# EAGLE schematic test (EAGLE 9.6.2)

## Sheet 1 of 3: Connectors
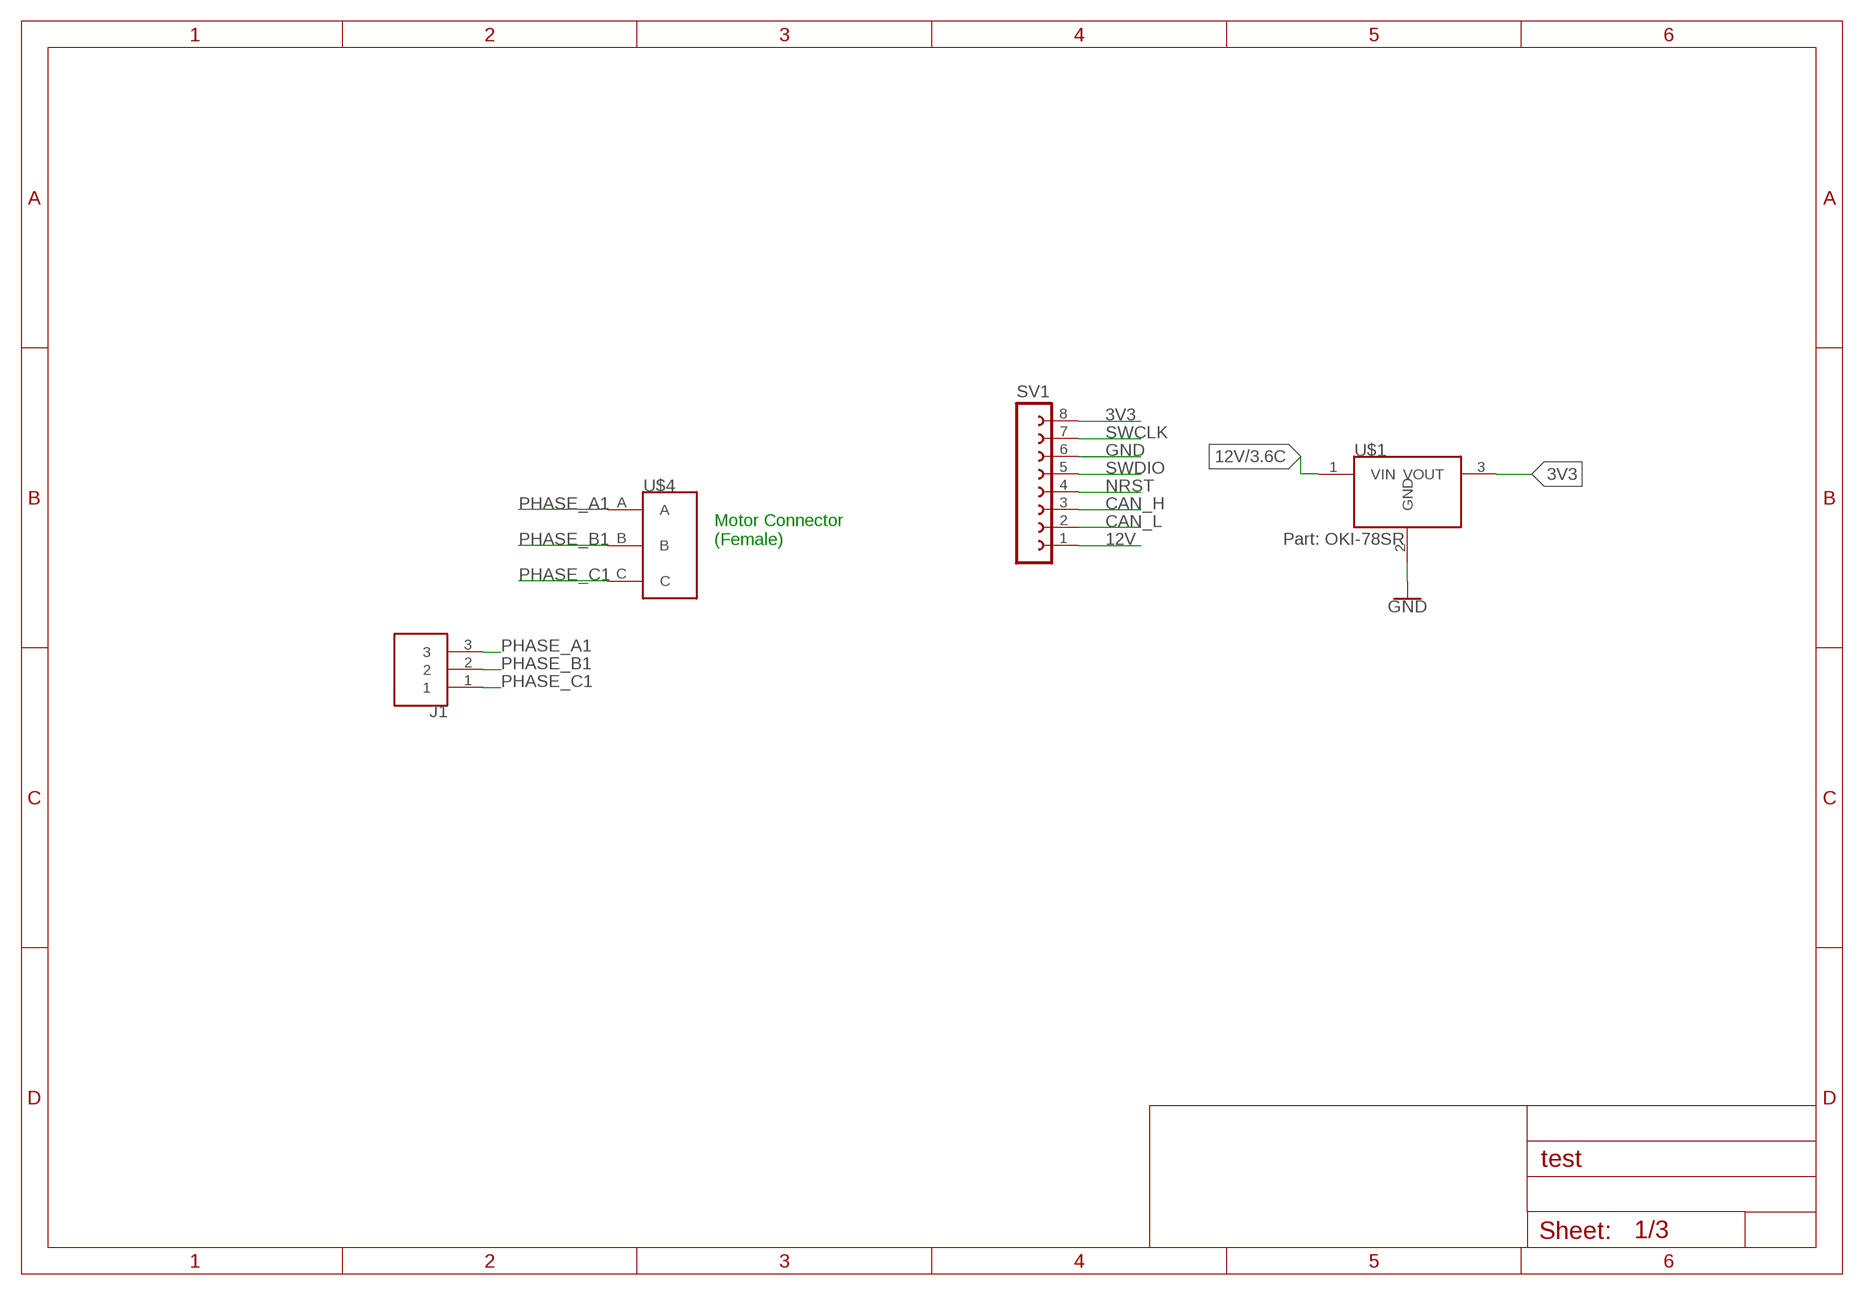
[diagram p0: schematic, sheet 1]

### Parts
J1  284512-3  [284512-3]
SV1  FE08-1  [FE08]
U$1  MURATA-DC-DC  [MURATA-DC-DC]
U$4  3PINCONNECTOR  [3PINCONNECTOR]

### Nets
3V3: SV1.8 U$1.3(VOUT) ; also sheet 2
12V: SV1.1 U$1.1(VIN) ; also sheet 3
CAN_H [diff_pair]: SV1.3 ; also sheet 2
CAN_L [diff_pair]: SV1.2 ; also sheet 2
GND: SV1.6 U$1.2(GND) ; also sheet 2,3
NRST: SV1.4 ; also sheet 2
PHASE_A1: J1.3 U$4.A ; also sheet 3
PHASE_B1: J1.2 U$4.B ; also sheet 3
PHASE_C1: J1.1 U$4.C ; also sheet 3
SWCLK: SV1.7 ; also sheet 2
SWDIO: SV1.5 ; also sheet 2

### Notes on the sheet
- Motor Connector
  (Female)

## Sheet 2 of 3: MCU
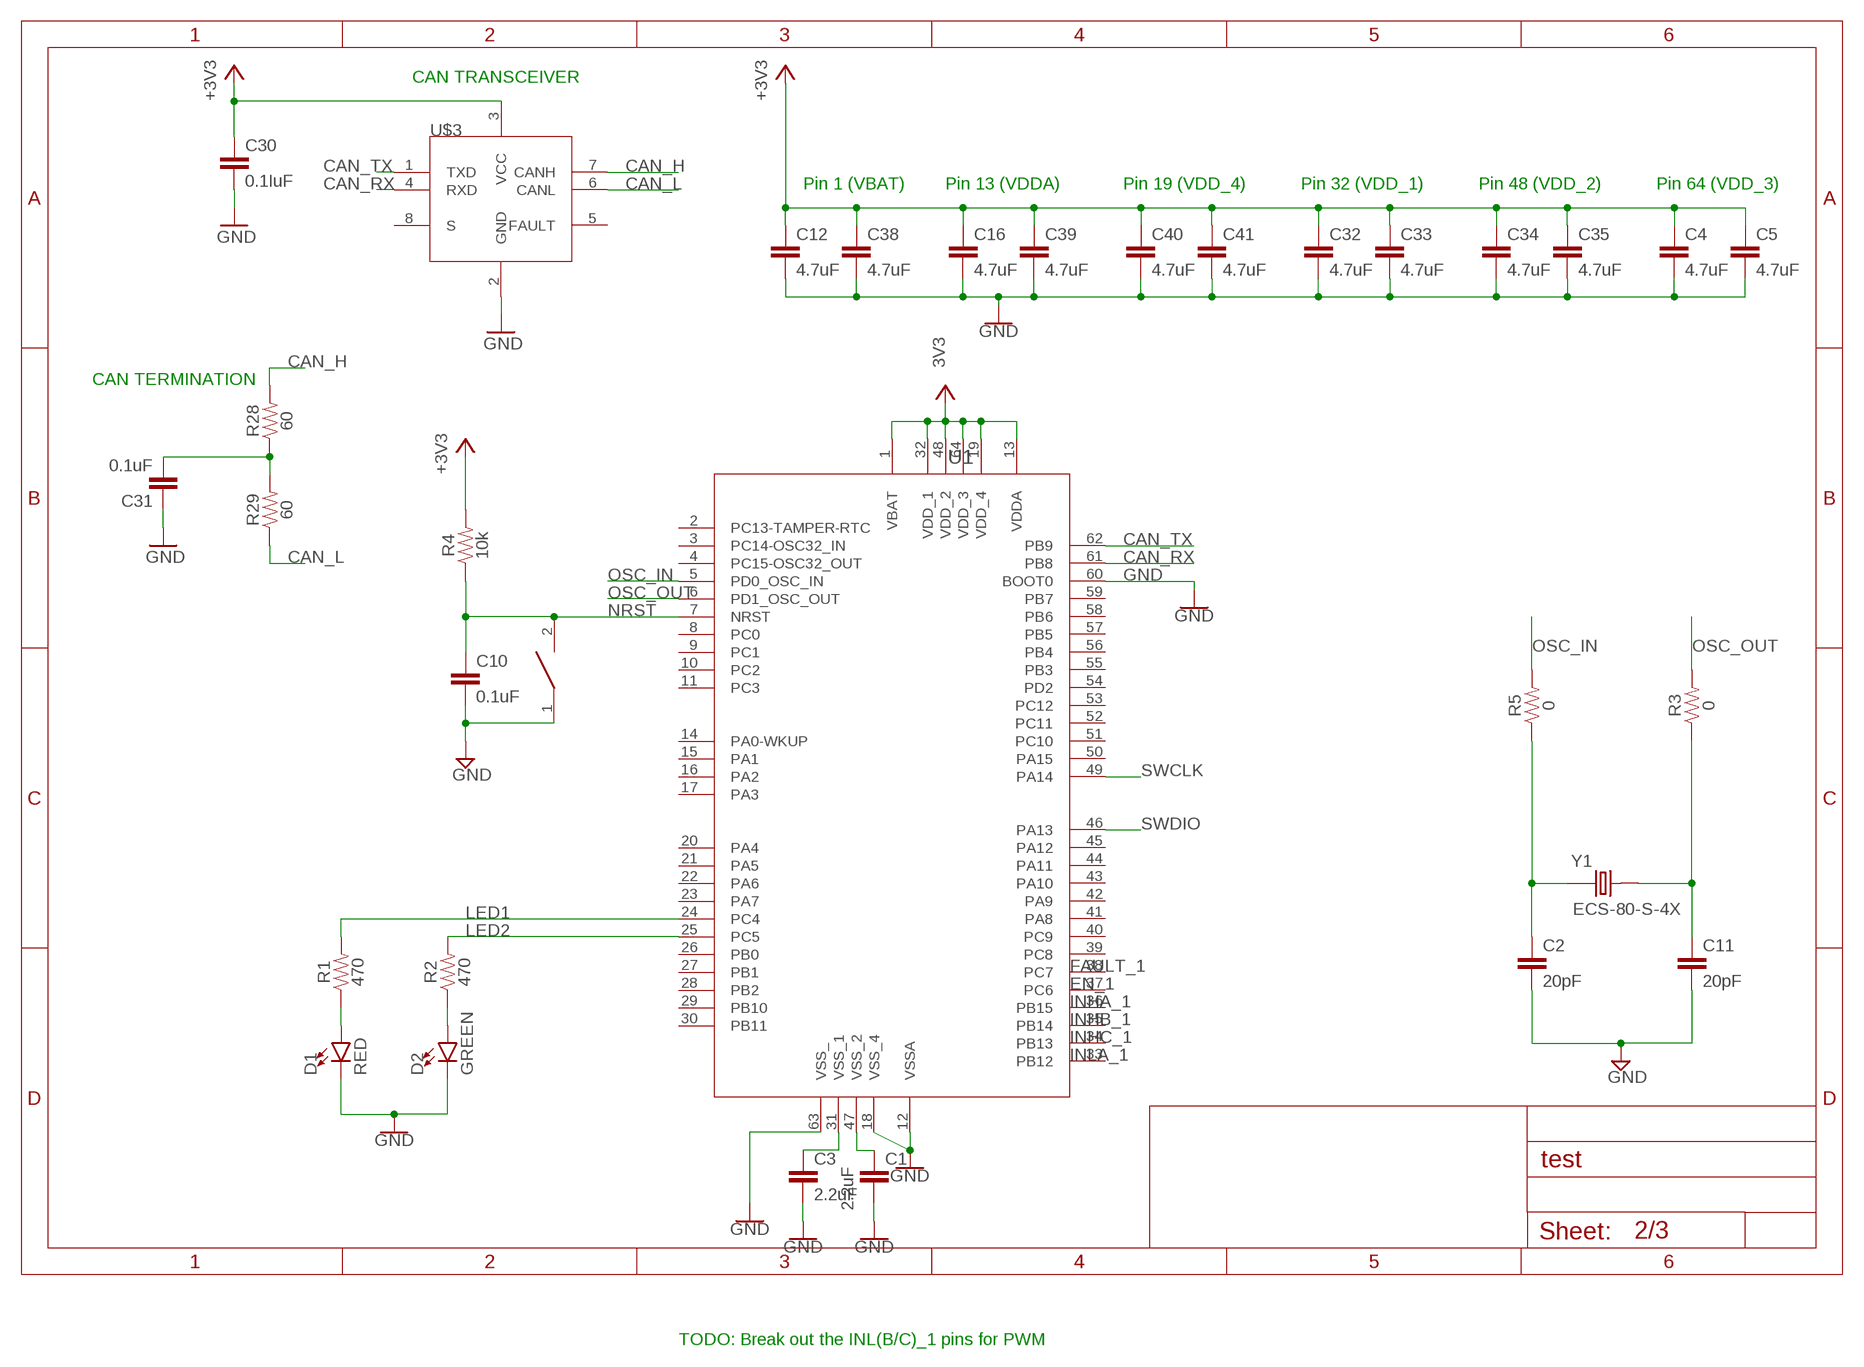
[diagram p1: schematic, sheet 2]

### Parts
C1  2.2uF  2.2UF-0603-10V-20%  [0603]
C2  20pF  4.7UF0603  [0603]
C3  2.2uF  2.2UF-0603-10V-20%  [0603]
C4  4.7uF  4.7UF0603  [0603]
C5  4.7uF  4.7UF0603  [0603]
C10  0.1uF  4.7UF0603  [0603]
C11  20pF  4.7UF0603  [0603]
C12  4.7uF  4.7UF0603  [0603]
C16  4.7uF  4.7UF0603  [0603]
C30  0.1IuF  4.7UF0603  [0603]
C31  0.1uF  0.1UF-0603-25V-(+80/-20%)  [0603]
C32  4.7uF  4.7UF0603  [0603]
C33  4.7uF  4.7UF0603  [0603]
C34  4.7uF  4.7UF0603  [0603]
C35  4.7uF  4.7UF0603  [0603]
C38  4.7uF  4.7UF0603  [0603]
C39  4.7uF  4.7UF0603  [0603]
C40  4.7uF  4.7UF0603  [0603]
C41  4.7uF  4.7UF0603  [0603]
D1  RED  LED-0805  [0805]
D2  GREEN  LED-0805  [0805]
R1  470  1KOHM-0603-1/10W-1%  [0603]
R2  470  1KOHM-0603-1/10W-1%  [0603]
R3  0  1KOHM-0603-1/10W-1%  [0603]
R4  10k  1KOHM-0603-1/10W-1%  [0603]
R5  0  1KOHM-0603-1/10W-1%  [0603]
R28  60  1KOHM-0603-1/10W-1%  [0603]
R29  60  1KOHM-0603-1/10W-1%  [0603]
RESET1  DISCRETECOMPONENTS_SWITCH  [DISCRETECOMPONENTS_SW_2512]
U1  STM32F405RGT6  [LQFP-64]
U$3  TCAN337D  [SOIC-8]
Y1  ECS-80-S-4X  [XTAL_ECS-80-S-4X]

### Nets
3V3: C4.1 C5.1 C12.1 C16.1 C30.1 C32.1 C33.1 C34.1 C35.1 C38.1 C39.1 C40.1 C41.1 R4.2 U1.1(VBAT) U1.13(VDDA) U1.19(VDD_4) U1.32(VDD_1) U1.48(VDD_2) U1.64(VDD_3) U$3.3(VCC) ; supply symbol labelled +3V3 ; also sheet 1
CAN_H [diff_pair]: R28.2 U$3.7(CANH) ; also sheet 1
CAN_L [diff_pair]: R29.1 U$3.6(CANL) ; also sheet 1
CAN_RX: U1.61(PB8) U$3.4(RXD)
CAN_TX: U1.62(PB9) U$3.1(TXD)
EN_1: U1.37(PC6) ; also sheet 3
FAULT_1: U1.38(PC7) ; also sheet 3
GND: C1.2 C2.2 C3.2 C4.2 C5.2 C10.2 C11.2 C12.2 C16.2 C30.2 C31.1 C32.2 C33.2 C34.2 C35.2 C38.2 C39.2 C40.2 C41.2 D1.C D2.C RESET1.1 U1.12(VSSA) U1.18(VSS_4) U1.60(BOOT0) U1.63(VSS_) U$3.2(GND) ; also sheet 1,3
INHA_1: U1.36(PB15) ; also sheet 3
INHB_1: U1.35(PB14) ; also sheet 3
INHC_1: U1.34(PB13) ; also sheet 3
INL_2: U1.39(PC8)
INLA_1: U1.33(PB12) ; also sheet 3
LED1: R1.2 U1.24(PC4)
LED1_MID: D1.A R1.1
LED2: R2.2 U1.25(PC5)
LED2_MID: D2.A R2.1
N$5: C1.1 U1.47(VSS_2)
N$6: C3.1 U1.31(VSS_1)
N$7: C11.1 R3.1 Y1.2
N$8: C2.1 R5.1 Y1.1
N$46: C31.2 R28.1 R29.2
NRST: C10.1 R4.1 RESET1.2 U1.7(NRST) ; also sheet 1
OSC_IN: R5.2 U1.5(PD0_OSC_IN)
OSC_OUT: R3.2 U1.6(PD1_OSC_OUT)
SWCLK: U1.49(PA14) ; also sheet 1
SWDIO: U1.46(PA13) ; also sheet 1
Unconnected: U1.2(PC13-TAMPER-RTC) U1.3(PC14-OSC32_IN) U1.4(PC15-OSC32_OUT) U1.8(PC0) U1.9(PC1) U1.10(PC2) U1.11(PC3) U1.14(PA0-WKUP) U1.15(PA1) U1.16(PA2) U1.17(PA3) U1.20(PA4) U1.21(PA5) U1.22(PA6) U1.23(PA7) U1.26(PB0) U1.27(PB1) U1.28(PB2) U1.29(PB10) U1.30(PB11) U1.40(PC9) U1.41(PA8) U1.42(PA9) U1.43(PA10) U1.44(PA11) U1.45(PA12) U1.50(PA15) U1.51(PC10) U1.52(PC11) U1.53(PC12) U1.54(PD2) U1.55(PB3) U1.56(PB4) U1.57(PB5) U1.58(PB6) U1.59(PB7) U$3.5(FAULT) U$3.8(S)

### Notes on the sheet
- CAN TRANSCEIVER
- Pin 1 (VBAT) | Pin 13 (VDDA) | Pin 19 (VDD_4) | Pin 32 (VDD_1) | Pin 48 (VDD_2) | Pin 64 (VDD_3)
- CAN TERMINATION
- TODO: Break out the INL(B/C)_1 pins for PWM

## Sheet 3 of 3: Gate Driver
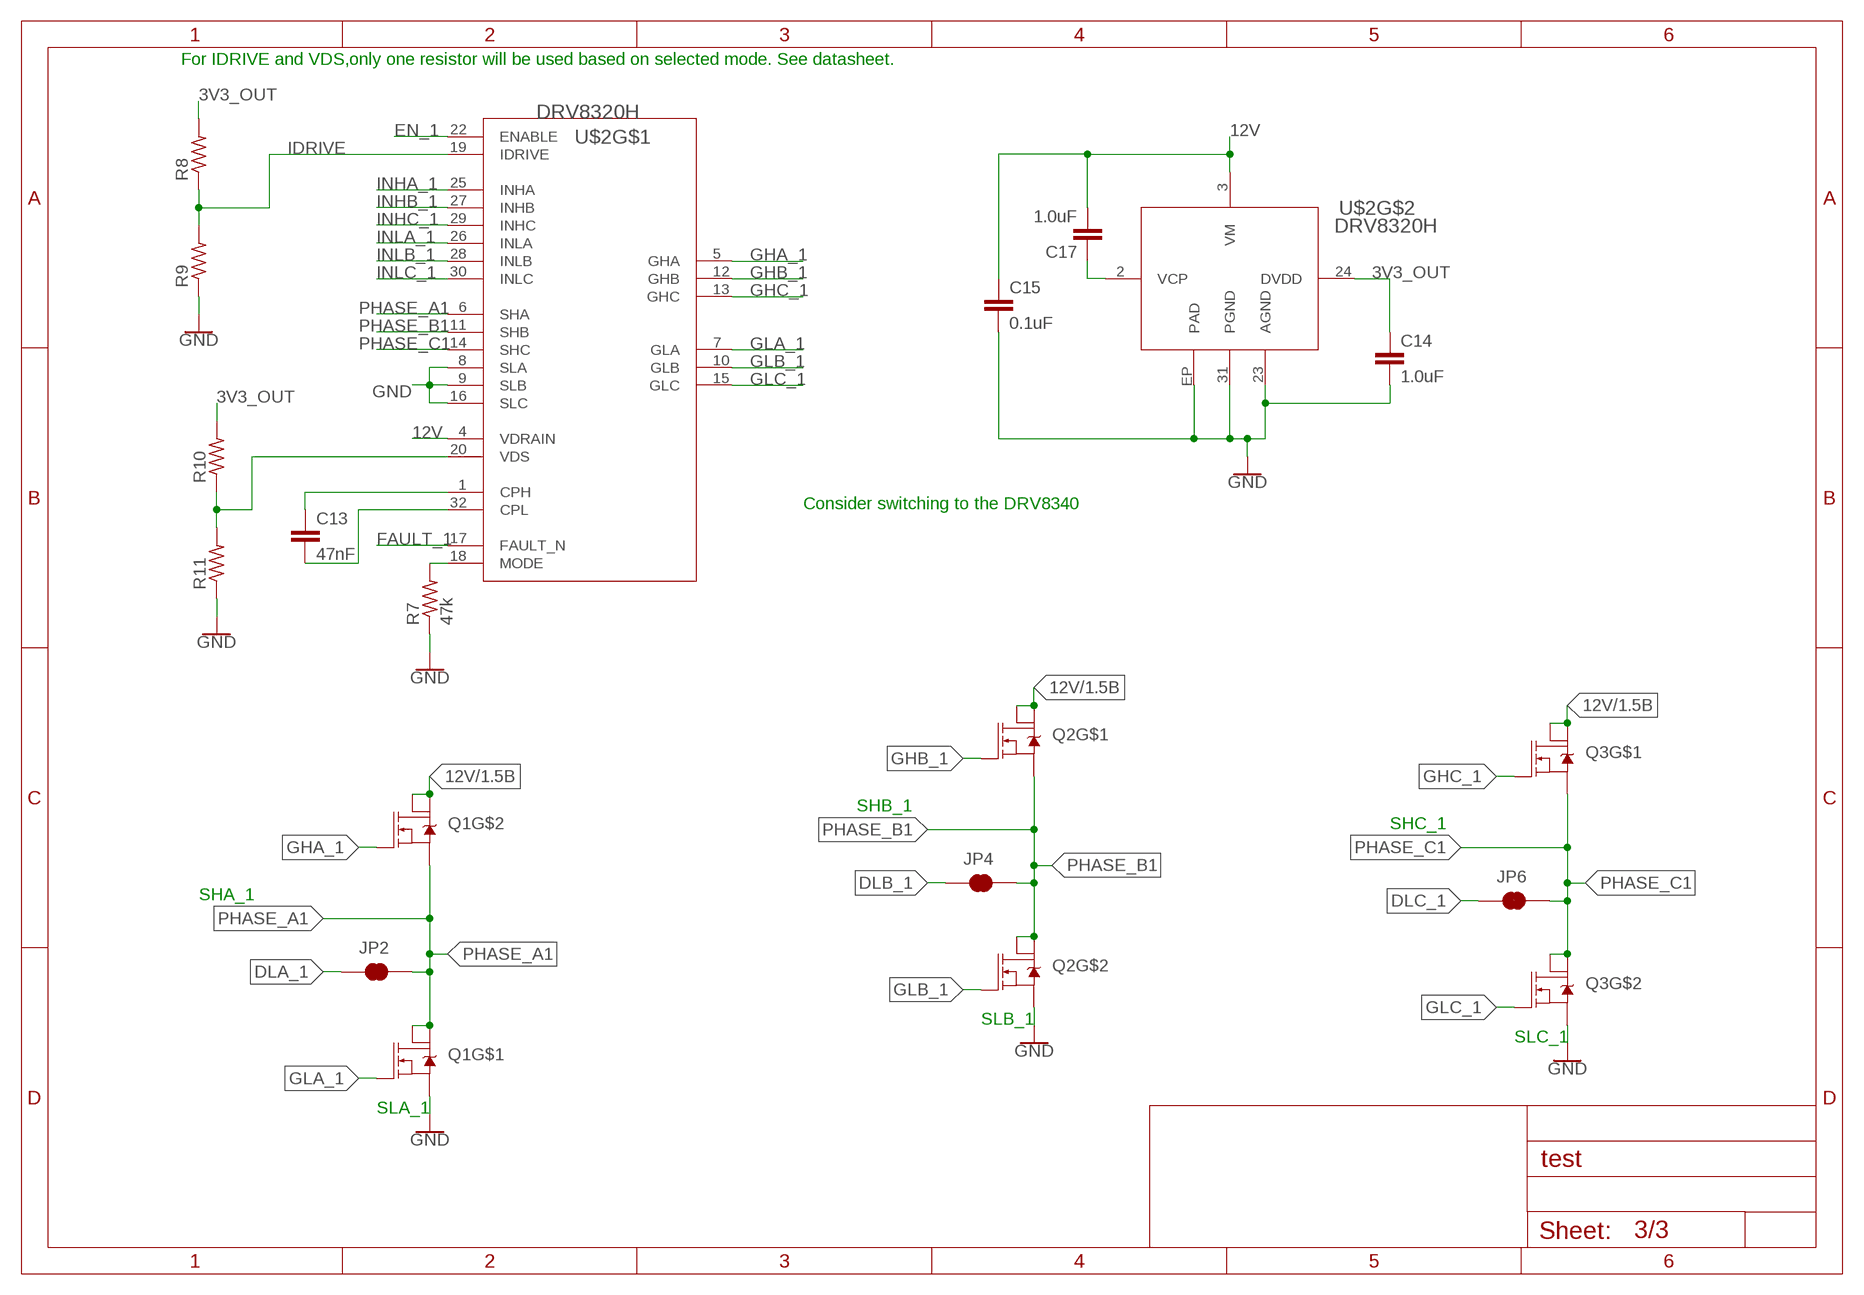
[diagram p2: schematic, sheet 3]

### Parts
C13  47nF  47NF-0603-25V-5%  [0603]
C14  1.0uF  1.0UF-0603-16V-10%  [0603]
C15  0.1uF  0.1UF-0603-25V-(+80/-20%)  [0603]
C17  1.0uF  1.0UF-0603-16V-10%  [0603]
JP2  JUMPER-SMT_2_NC_TRACE_SILK  [SMT-JUMPER_2_NC_TRACE_SILK]
JP4  JUMPER-SMT_2_NC_TRACE_SILK  [SMT-JUMPER_2_NC_TRACE_SILK]
JP6  JUMPER-SMT_2_NC_TRACE_SILK  [SMT-JUMPER_2_NC_TRACE_SILK]
Q1  DUAL-NMOS  [SO08]
Q2  DUAL-NMOS  [SO08]
Q3  DUAL-NMOS  [SO08]
R7  47k  R-US_R0603  [R0603]
R8  R-US_R0603  [R0603]
R9  R-US_R0603  [R0603]
R10  R-US_R0603  [R0603]
R11  R-US_R0603  [R0603]
U$2  DRV8320H  [QFN-32-5X5MM]

### Nets
3V3_OUT: C14.1 R8.2 R10.2 U$2.24(DVDD)
12V: C15.1 C17.2 Q1.5(D1) Q1.6(D2) Q2.7(D1) Q2.8(D2) Q3.7(D1) Q3.8(D2) U$2.3(VM) U$2.4(VDRAIN) ; also sheet 1
CPH: C13.1 U$2.1(CPH)
CPL: C13.2 U$2.32(CPL)
DLA_1: JP2.1
DLB_1: JP4.1
DLC_1: JP6.1
EN_1: U$2.22(ENABLE) ; also sheet 2
FAULT_1: U$2.17(FAULT_N) ; also sheet 2
GHA_1: Q1.4(G) U$2.5(GHA)
GHB_1: Q2.2(G) U$2.12(GHB)
GHC_1: Q3.2(G) U$2.13(GHC)
GLA_1: Q1.2(G) U$2.7(GLA)
GLB_1: Q2.4(G) U$2.10(GLB)
GLC_1: Q3.4(G) U$2.15(GLC)
GND: C14.2 C15.2 Q1.1(S) Q2.3(S) Q3.3(S) R7.1 R9.1 R11.1 U$2.8(SLA) U$2.9(SLB) U$2.16(SLC) U$2.23(AGND) U$2.31(PGND) U$2.EP(PAD) ; also sheet 1,2
IDRIVE: R8.1 R9.2 U$2.19(IDRIVE)
INHA_1: U$2.25(INHA) ; also sheet 2
INHB_1: U$2.27(INHB) ; also sheet 2
INHC_1: U$2.29(INHC) ; also sheet 2
INLA_1: U$2.26(INLA) ; also sheet 2
INLB_1: U$2.28(INLB)
INLC_1: U$2.30(INLC)
MODE: R7.2 U$2.18(MODE)
N$19: R10.1 R11.2 U$2.20(VDS)
PHASE_A1: JP2.2 Q1.3(S) Q1.7(D1) Q1.8(D2) U$2.6(SHA) ; also sheet 1
PHASE_B1: JP4.2 Q2.1(S) Q2.5(D1) Q2.6(D2) U$2.11(SHB) ; also sheet 1
PHASE_C1: JP6.2 Q3.1(S) Q3.5(D1) Q3.6(D2) U$2.14(SHC) ; also sheet 1
V_CAP_L: C17.1 U$2.2(VCP)

### Notes on the sheet
- For IDRIVE and VDS,only one resistor will be used based on selected mode. See datasheet.
- Consider switching to the DRV8340
- SHB_1
- SHC_1
- SHA_1
- SLB_1
- SLC_1
- SLA_1

## Library data of the parts
C1 C3 = SparkFun-Capacitors:2.2UF: 2.2µF ceramic capacitors A capacitor is a passive two-terminal electrical component used to store electrical energy temporarily in an electric field.; PROD_ID: CAP-07888
C2 C10 C11 C30 = SparkFun-Capacitors:4.7UF: 4.7µF ceramic capacitors A capacitor is a passive two-terminal electrical component used to store electrical energy temporarily in an electric field.; PROD_ID: CAP-08280; VALUE: 4.7uF
C4 C5 C12 C16 C32-C35 C38-C41 = SparkFun-Capacitors:4.7UF: 4.7µF ceramic capacitors A capacitor is a passive two-terminal electrical component used to store electrical energy temporarily in an electric field.; PROD_ID: CAP-08280
C13 = SparkFun-Capacitors:47NF: 47nF ceramic capacitors A capacitor is a passive two-terminal electrical component used to store electrical energy temporarily in an electric field.; PROD_ID: CAP-08605
C14 C17 = SparkFun-Capacitors:1.0UF: 1µF ceramic capacitors A capacitor is a passive two-terminal electrical component used to store electrical energy temporarily in an electric field.; PROD_ID: CAP-00868
C15 C31 = SparkFun-Capacitors:0.1UF: 0.1µF ceramic capacitors A capacitor is a passive two-terminal electrical component used to store electrical energy temporarily in an electric field.; PROD_ID: CAP-00810
D1 D2 = LED-0805:LED-0805; VALUE: COLOR
J1 = ThrusterConnector:284512-3
JP2 JP4 JP6 = SparkFun-Jumpers:JUMPER-SMT_2_NC_TRACE: Normally closed trace jumper This jumper has a trace between two pads so it's normally closed (NC). Use a razor knife to open the connection. For best results follow the IPC guidelines for cutting traces: Cutout at least 0.063 mm (0.005 in). Remove all loose material to clean up the cut area. Seal the cut with an approved epoxy. Reapply solder to reclose the connection.
Q1-Q3 = Dual NMOS:DUAL-NMOS: Recommend TI CSD88537ND
R1-R5 R28 R29 = SparkFun-Resistors:1KOHM: 1kΩ resistor A resistor is a passive two-terminal electrical component that implements electrical resistance as a circuit element. Resistors act to reduce current flow, and, at the same time, act to lower voltage levels within circuits. - Wikipedia; PROD_ID: RES-07856; VALUE: 1k
R7-R11 = rcl:R-US_: RESISTOR, American symbol; SPICEPREFIX: R
RESET1 = Push button - FSM2JMTR:DISCRETECOMPONENTS_SWITCH: TE Connectivity FSM2JMTR Switch
SV1 = con-lsta:FE08-1: FEMALE HEADER; OC_FARNELL: unknown; OC_NEWARK: unknown
U1 = STM32F405RGT6:STM32F405RGT6: Microcontroller; MANUFACTURER_PART_NUMBER: STM32F405RGT6; VENDOR: STMicroelectronics
U$1 = MURATA_3pin_dcdc:MURATA-DC-DC
U$2 = Motor Driver - DRV8320HRTVT:DRV8320H
U$3 = STM and CAN parts:TCAN337D
U$4 = afro_20A_esc:3PINCONNECTOR
Y1 = ECS-80-S-4X:ECS-80-S-4X: CRYSTAL T/H; DESCRIPTION: Crystal 8MHz Series 2-Pin HC-49/U; DIGI-KEY_PART_NUMBER: X1057-ND; DIGI-KEY_PURCHASE_URL: https://www.digikey.com/product-detail/en/ecs-inc/ECS-80-S-4X/X1057-ND/827549?utm_source=snapeda&utm_medium=aggregator&utm_campaign=symbol; MF: ECS International; MP: ECS-80-S-4X; PACKAGE: HC-49/US ECS International

## Net classes
0 default: width 0.203 mm
1 diff_pair: width 0.203 mm, clearance 0.203 mm